# EAGLE design BlueFly-Shield_v10 (EAGLE 7.5.0)
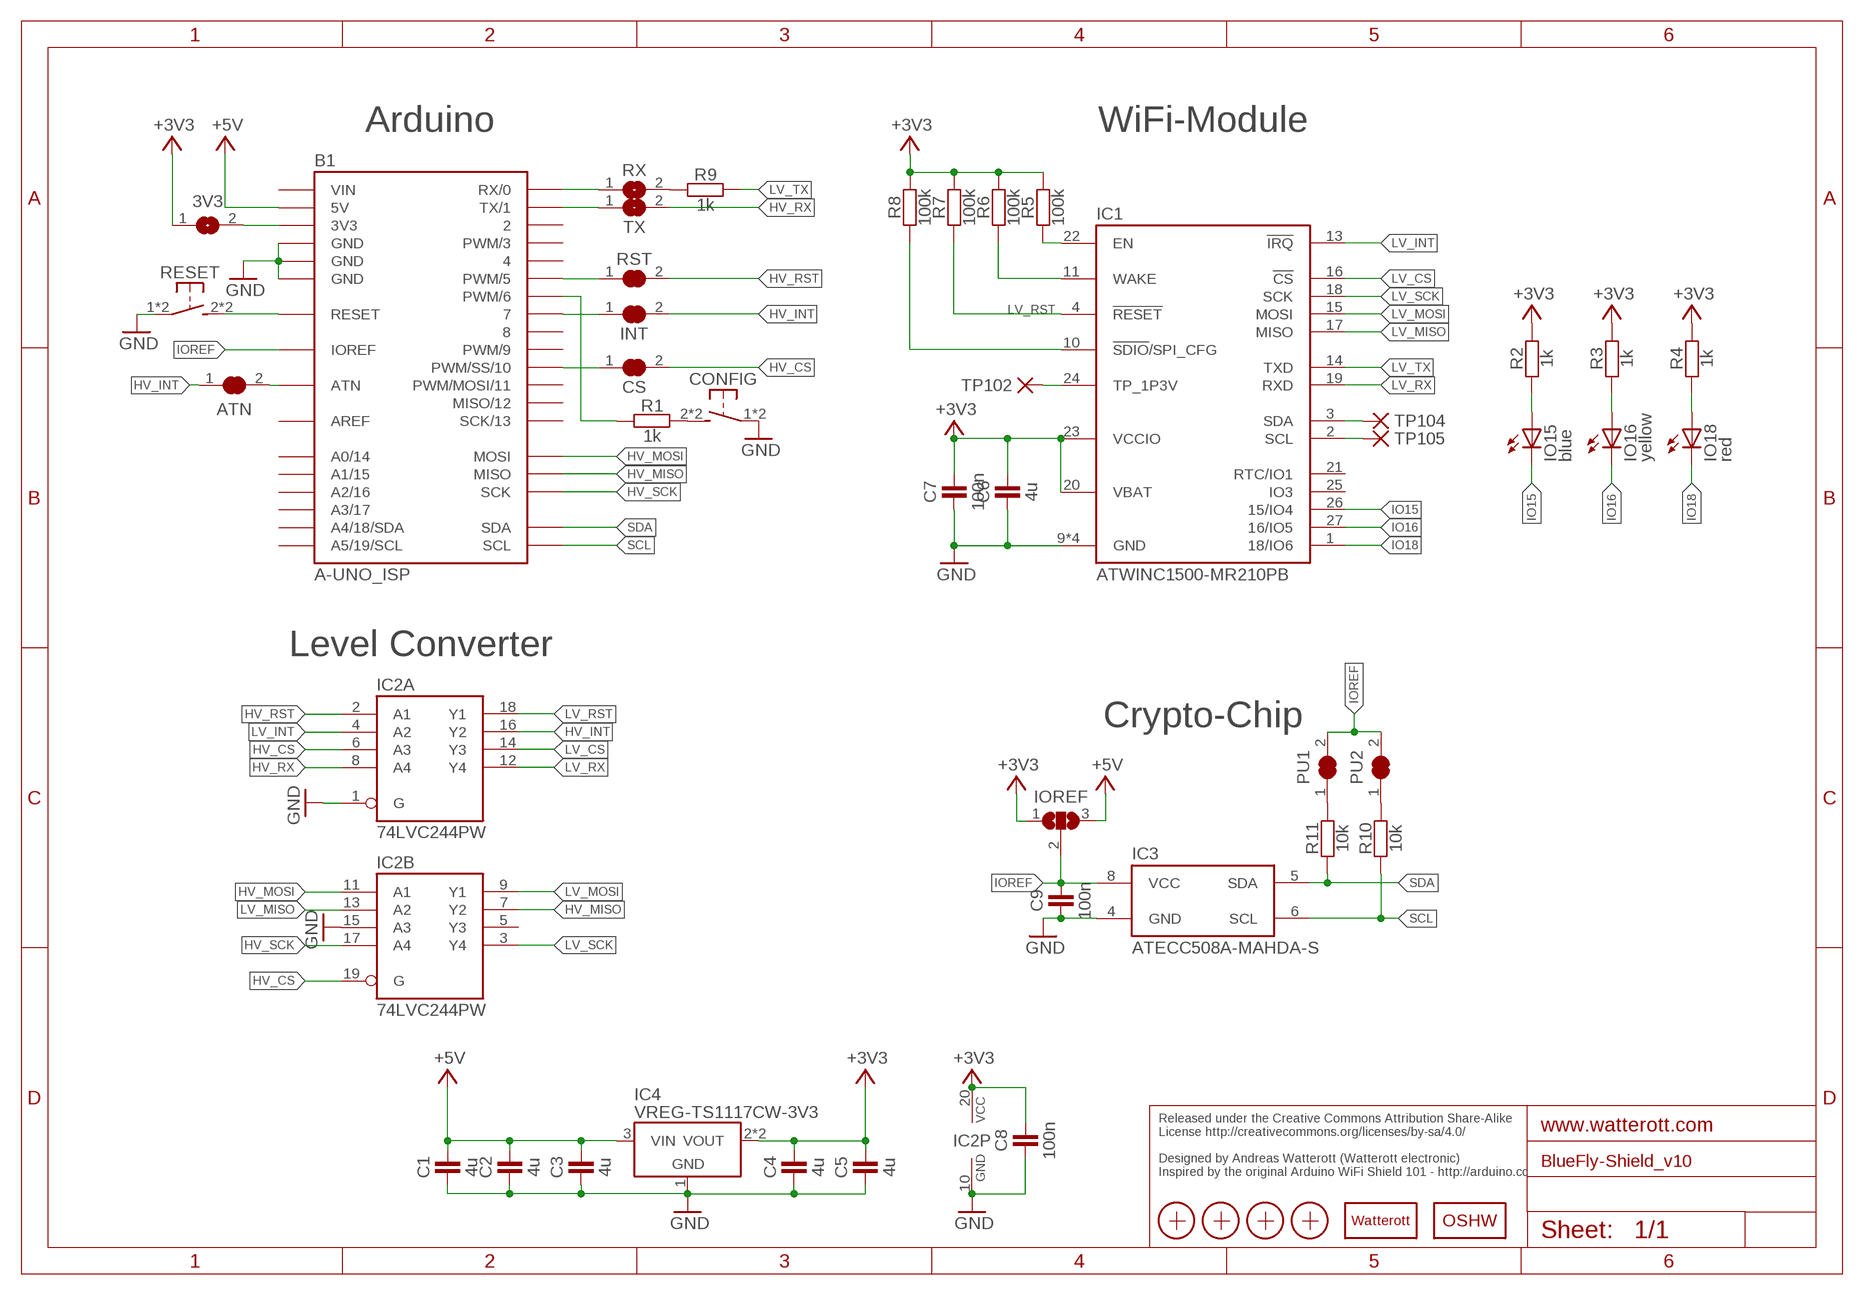
[diagram p0: schematic, sheet 1]

## Parts
3V3  JUMPER2-0603-NC  [JUMPER2-0603_NC]
ATN  JUMPER2-0603-NC  [JUMPER2-0603_NC]
B1  A-UNO_ISP  [A-UNO-ISP]
C1  4u  CAPACITOR-0603  [C0603]
C2  4u  CAPACITOR-0603  [C0603]
C3  4u  CAPACITOR-0603  [C0603]
C4  4u  CAPACITOR-0603  [C0603]
C5  4u  CAPACITOR-0603  [C0603]
C6  4u  CAPACITOR-0603  [C0603]
C7  100n  CAPACITOR-0603  [C0603]
C8  100n  CAPACITOR-0402  [C0402]
C9  100n  CAPACITOR-0402  [C0402]
CONFIG  SW-TACTILE-TL3315  [TL3315N]
CS  JUMPER2-0603-NC  [JUMPER2-0603_NC]
IC1  ATWINC1500-MR210PB  [ATWINC1500-MX210]
IC2  74LVC244PW  [TSSOP20]
IC3  ATECC508A-MAHDA-S  [UDFN8]
IC4  VREG-TS1117CW-3V3  [SOT223]
INT  JUMPER2-0603-NC  [JUMPER2-0603_NC]
IO15  blue  LED-0603  [C0603]
IO16  yellow  LED-0603  [C0603]
IO18  red  LED-0603  [C0603]
IOREF  JUMPER3-0603-NC  [JUMPER3-0603_NC]
LOGO1  LOGO-S_PLACE_M  [SPARK_TPLACE_M]
LOGO2  OSHW_LOGOX0100  [OSHW_6X100]
PU1  JUMPER2-0603-NC  [JUMPER2-0603_NC]
PU2  JUMPER2-0603-NC  [JUMPER2-0603_NC]
R1  1k  RESISTOR-0402  [C0402]
R2  1k  RESISTOR-0402  [C0402]
R3  1k  RESISTOR-0402  [C0402]
R4  1k  RESISTOR-0402  [C0402]
R5  100k  RESISTOR-0402  [C0402]
R6  100k  RESISTOR-0402  [C0402]
R7  100k  RESISTOR-0402  [C0402]
R8  100k  RESISTOR-0402  [C0402]
R9  1k  RESISTOR-0402  [C0402]
R10  10k  RESISTOR-0402  [C0402]
R11  10k  RESISTOR-0402  [C0402]
RESET  SW-TACTILE-TL3315  [TL3315N]
RST  JUMPER2-0603-NC  [JUMPER2-0603_NC]
RX  JUMPER2-0603-NC  [JUMPER2-0603_NC]
TP102  PAD-1.27X1.27_NC  [PAD-1.27X1.27_NC]
TP104  PAD-1.27X1.27_NC  [PAD-1.27X1.27_NC]
TP105  PAD-1.27X1.27_NC  [PAD-1.27X1.27_NC]
TX  JUMPER2-0603-NC  [JUMPER2-0603_NC]
X1  PASSER-07  [PASSER_07MM]
X2  PASSER-07  [PASSER_07MM]
X3  PASSER-07  [PASSER_07MM]
X4  PASSER-07  [PASSER_07MM]

## Nets
3V3: 3V3.2 B1.3V3
+3V3: 3V3.1 C4.2 C5.2 C6.2 C7.2 C8.2 IC1.20(VBAT) IC1.23(VCCIO) IC2.20(P:VCC) IC4.2(VOUT) IC4.4(VOUT) IOREF.1 R2.2 R3.2 R4.2 R5.2 R6.2 R7.2 R8.2
+5V: B1.5V C1.2 C2.2 C3.2 IC4.3(VIN) IOREF.3
ATN: ATN.2 B1.ATN
BTN: CONFIG.2(S1) CONFIG.3(S1) R1.2
D0: B1.0(RX/0) RX.1
D1: B1.1(TX/1) TX.1
D5: B1.5(PWM/5) RST.1
D7: B1.7 INT.1
D10: B1.10(PWM/SS/10) CS.1
DF6: B1.6(PWM/6) R1.1
GND: B1.GND@1(GND) B1.GND@2(GND) B1.GND@3(GND) C1.1 C2.1 C3.1 C4.1 C5.1 C6.1 C7.1 C8.1 C9.1 CONFIG.1 CONFIG.4(P1) IC1.9(GND) IC1.12(GND) IC1.28(GND) IC1.GND IC2.1(A:G) IC2.10(P:GND) IC2.15(B:A3) IC3.4(GND) IC4.1(GND) RESET.1 RESET.4(P1)
HV_CS: CS.2 IC2.6(A:A3) IC2.19(B:G)
HV_INT: ATN.1 IC2.16(A:Y2) INT.2
HV_MISO: B1.MISO IC2.7(B:Y2)
HV_MOSI: B1.MOSI IC2.11(B:A1)
HV_RST: IC2.2(A:A1) RST.2
HV_RX: IC2.8(A:A4) TX.2
HV_SCK: B1.SCK IC2.17(B:A4)
IO15: IC1.26(15/IO4) IO15.C
IO16: IC1.27(16/IO5) IO16.C
IO18: IC1.1(18/IO6) IO18.C
IOREF: B1.IOREF C9.2 IC3.8(VCC) IOREF.2 PU1.2 PU2.2
LED15: IO15.A R2.1
LED16: IO16.A R3.1
LED18: IO18.A R4.1
LV_CS: IC1.16(!CS) IC2.14(A:Y3)
LV_EN: IC1.22(EN) R5.1
LV_INT: IC1.13(!IRQ) IC2.4(A:A2)
LV_MISO: IC1.17(MISO) IC2.13(B:A2)
LV_MOSI: IC1.15(MOSI) IC2.9(B:Y1)
LV_RST: IC1.4(!RESET) IC2.18(A:Y1) R7.1
LV_RX: IC1.19(RXD) IC2.12(A:Y4)
LV_SCK: IC1.18(SCK) IC2.3(B:Y4)
LV_TX: IC1.14(TXD) R9.2
LV_WAKE: IC1.11(WAKE) R6.1
N$1: R9.1 RX.2
N$6: PU2.1 R10.2
N$7: PU1.1 R11.2
RST: B1.RST@1(RESET) RESET.2(S1) RESET.3(S1)
SCL: B1.SCL IC3.6(SCL) R10.1
SDA: B1.SDA IC3.5(SDA) R11.1
SPI_CFG: IC1.10(!SDIO!/SPI_CFG) R8.1
TP: IC1.24(TP_1P3V) TP102.1(P)
WIFI_SCL: IC1.2(SCL) TP105.1(P)
WIFI_SDA: IC1.3(SDA) TP104.1(P)
Unconnected: B1.2 B1.3(PWM/3) B1.4 B1.8 B1.9(PWM/9) B1.11(PWM/MOSI/11) B1.12(MISO/12) B1.13(SCK/13) B1.A0(A0/14) B1.A1(A1/15) B1.A2(A2/16) B1.A3(A3/17) B1.A4(A4/18/SDA) B1.A5(A5/19/SCL) IC1.21(RTC/IO1) IC1.25(IO3) IC2.5(B:Y3)

## Notes on the sheet
- Arduino | WiFi-Module
- Level Converter
- Crypto-Chip
- Released under the Creative Commons Attribution Share-Alike
  License http://creativecommons.org/licenses/by-sa/4.0/
  
  Designed by Andreas Watterott (Watterott electronic)
  Inspired by the original Arduino WiFi Shield 101 - http://arduino.cc

## Power pins joined to a net without a drawn wire
AREF: B1.AREF
VIN: B1.VIN

## Library data of the parts
3V3 ATN CS INT PU1 PU2 RST RX TX = we-rcl:JUMPER2: 2 Pin Jumpers
B1 = we-board:A-UNO_ISP: Arduino/Genuino Uno with ISP connector
C1-C9 = we-rcl:CAPACITOR: Capacitors ...2.2uF @ 6.3V -> 0402 ...4.7uF @ 6.3V -> 0603 ...10uF @ 16V -> 0805 ...22uF @ 25V -> 1206
CONFIG RESET = we-switch:SW-TACTILE: Tactile Switches; DIGIKEY: EG4621TR-ND
IC1 = we-chip:ATWINC1500: Atmel ATWINC1500-MR210 WiFi/WLAN 802.11 b/g/n MR210PB - PCB antenna MR210UB - uFL connector
IC2 = we-chip:74*244: 74x244 Octal Buffer and Line Driver (3-State); DIGIKEY: 568-1583-2-ND
IC3 = we-chip:ATECC508A: Atmel ATECC508A Crypto-Authentication Device
IC4 = we-power:VREG: Voltage Regulators (LDOs, Switching Converters...) LDOs Taiwan Semi TS1117 800mA max 15V - compatible On Semi NCP1117 1A max 20V Taiwan Semi TS9011 250mA max 12V - compatible Diodes AP2210 300mA max 15V - compatible Microchip MCP1702 250mA max 13V - compatible Microchip MCP1703 250mA max 16V - compatible Microchip MCP1754 150mA max 16V Taiwan Semi TS5204 150mA max 16V (low noise) DC/DC Converter Modules Recom R-78Ex.x-1.0-W36 1A max 28V Murata OKI-78SR-x.x/1.5-W36 1.5A max 36V
IO15 IO16 IO18 = we-opto:LED: LEDs red, green, blue -> 0603
IOREF = we-rcl:JUMPER3: 3 Pin Jumpers
LOGO1 = we-symbol:LOGO: Watterott electronic Logo
LOGO2 = we-symbol:OSHW_LOGO: Open-Source-Hardware Logo
R1-R11 = we-rcl:RESISTOR: Resistors all kinds in 0402 and 0603
TP102 TP104 TP105 = we-rcl:PAD: Pads
X1-X4 = we-symbol:PASSER: Fiducial Markers

## Board
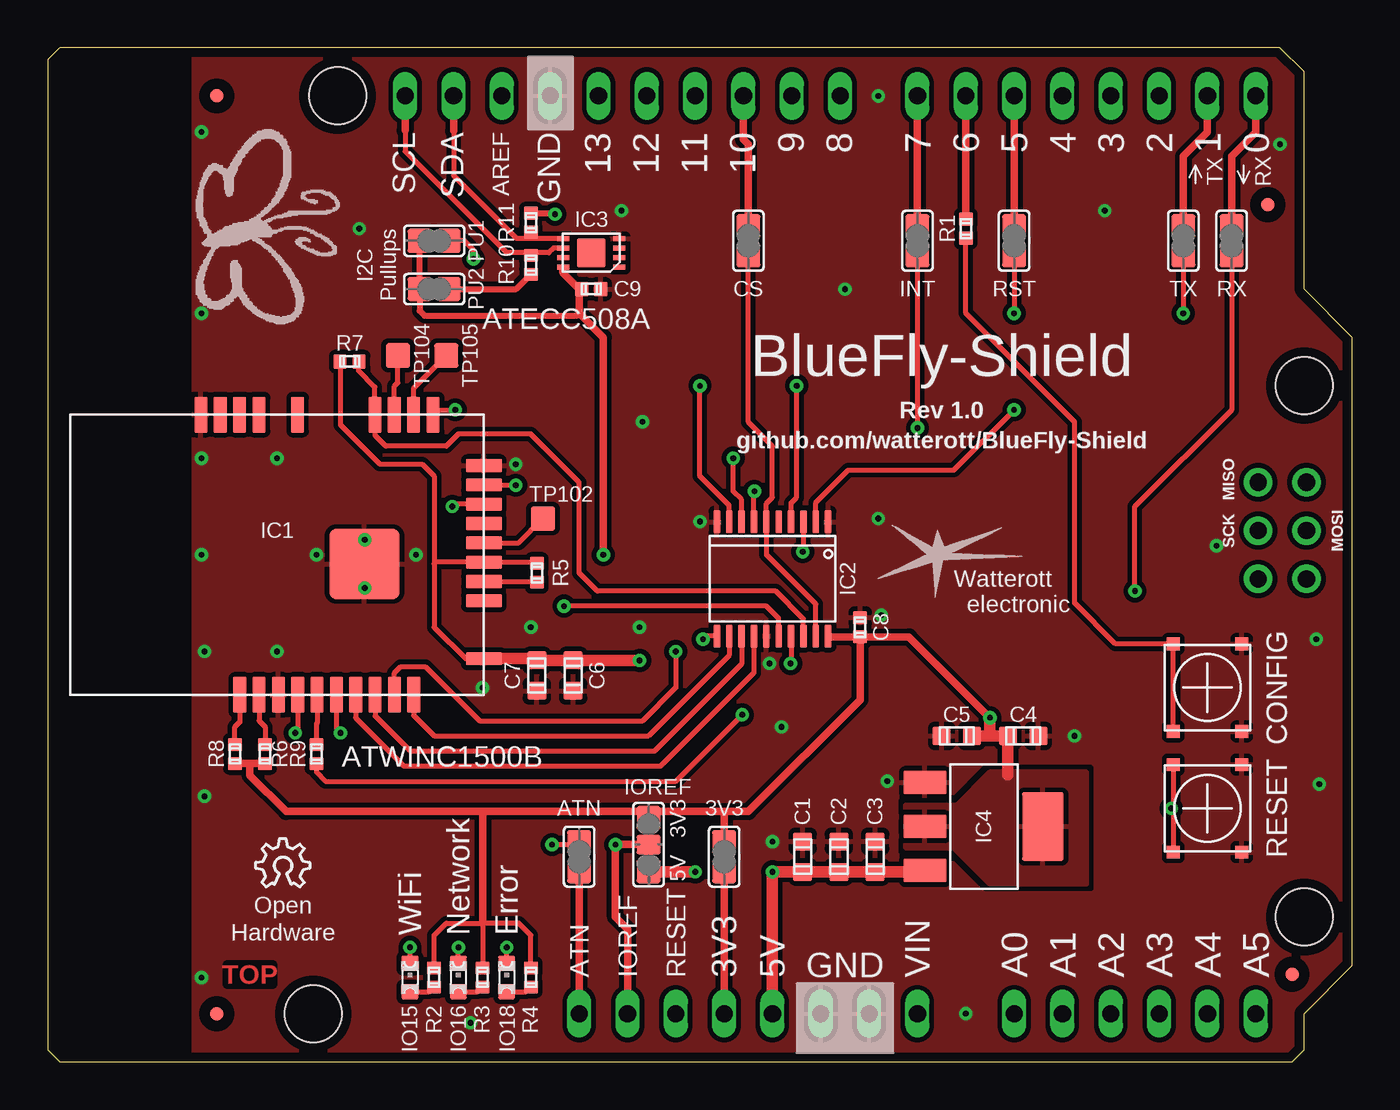
[diagram p1: board, top side]
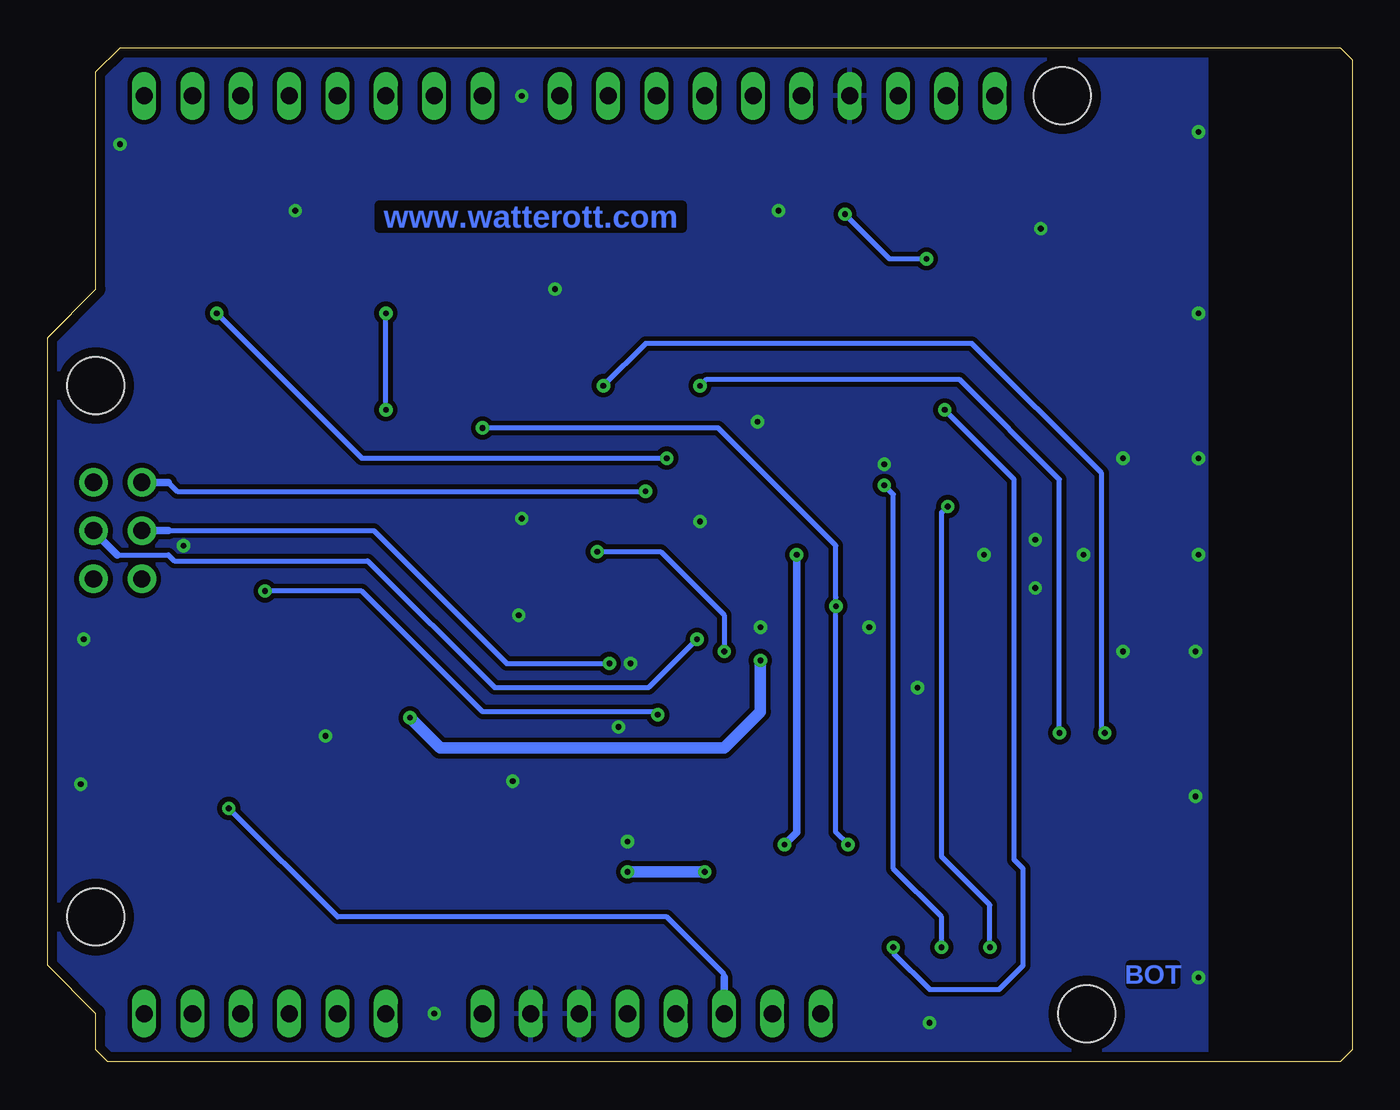
[diagram p2: board, bottom side, seen from below]

Size 68.58 x 53.34 mm. Coordinates in mm from the lower left corner, seen from the top.
Copper layers (1*16): Top 0.035mm / dielectric 1.5mm / Bottom 0.035mm
Design rules "we-dru-2-layer": minimum track width 0.15mm, minimum drill 0.3mm, track to track 0.15mm, track to pad 0.15mm, pad to pad 0.15mm, via to via 0.15mm, smd to smd 0.1mm, copper to edge 0.5mm, drill to drill 0.2mm, minimum pad ring 0.18mm, minimum via ring 0.2mm, stop-mask expansion 0.1mm, vias tented up to drill 0.5mm, thermal gap 0.25mm
tRestrict: area 0,0 to 7.3,53.3
bRestrict: area 0,0 to 7.3,53.3

### Footprints (pad centres in the part's own frame; a part is rotated, then mirrored left to right if it is on the bottom)
JUMPER2-0603_NC = smd 1.25 x 1.25: 1 0,0.76; 2 0,-0.76
A-UNO-ISP = drill 0.9 pad 1.2 long: 0 63.5,50.8; 1 60.96,50.8; 2 58.42,50.8; 3 55.88,50.8; 3V3 35.56,2.54; 4 53.34,50.8; 5 50.8,50.8; 5V 38.1,2.54; 6 48.26,50.8; 7 45.72,50.8; 8 41.656,50.8; 9 39.116,50.8; 10 36.576,50.8; 11 34.036,50.8; 12 31.496,50.8; 13 28.956,50.8; A0 50.8,2.54; A1 53.34,2.54; A2 55.88,2.54; A3 58.42,2.54; A4 60.96,2.54; A5 63.5,2.54; AREF 23.876,50.8; ATN 27.94,2.54; GND@1 40.64,2.54; GND@2 43.18,2.54; GND@3 26.416,50.8; IOREF 30.48,2.54; RST@1 33.02,2.54; SCL 18.796,50.8; SDA 21.336,50.8; VIN 45.72,2.54 | drill 0.9 pad 1.5: GND@4 66.167,25.4; MISO 63.627,30.48; MOSI 66.167,27.94; RST@2 63.627,25.4; SCK 63.627,27.94; VCC 66.167,30.48 | hole 3: 66.04,35.56; 66.04,7.62; 15.24,50.8; 13.97,2.54
C0603 = smd 1 x 0.95: 1 0,0.8; 2 0,-0.8
C0402 = smd 0.75 x 0.7: 1 0,0.5; 2 0,-0.5
TL3315N = smd 0.65 x 0.7: 1 -2.3,1.8; 2 -2.3,-1.8; 3 2.3,-1.8; 4 2.3,1.8
ATWINC1500-MX210 = smd 1.9 x 0.7: 1 7.365,-8.19; 2 7.365,-7.174; 3 7.365,-6.158; 4 7.365,-5.142; 5 7.365,-1.078; 6 7.365,0.954; 7 7.365,1.97; 8 7.365,2.986; 9 7.365,4.002; 10 -7.365,1.964; 11 -7.365,0.948; 12 -7.365,-0.068; 13 -7.365,-1.084; 14 -7.365,-2.1; 15 -7.365,-3.116; 16 -7.365,-4.132; 17 -7.365,-5.148; 18 -7.365,-6.164; 19 -7.365,-7.18 | smd 0.7 x 1.9: 20 -5.465,-10.86; 21 -2.417,-10.86; 22 -1.401,-10.86; 23 -0.385,-10.86; 24 0.631,-10.86; 25 1.647,-10.86; 26 2.663,-10.86; 27 3.679,-10.86; 28 4.695,-10.86 | smd 3.7 x 3.7: GND -0.485,-4.59
TSSOP20 = smd 1.2 x 0.35: 1 -3,2.925; 2 -3,2.275; 3 -3,1.625; 4 -3,0.975; 5 -3,0.325; 6 -3,-0.325; 7 -3,-0.975; 8 -3,-1.625; 9 -3,-2.275; 10 -3,-2.925; 11 3,-2.925; 12 3,-2.275; 13 3,-1.625; 14 3,-0.975; 15 3,-0.325; 16 3,0.325; 17 3,0.975; 18 3,1.625; 19 3,2.275; 20 3,2.925
UDFN8 = smd 0.7 x 0.28: 1 -1.475,0.75; 2 -1.475,0.25; 3 -1.475,-0.25; 4 -1.475,-0.75; 5 1.475,-0.75; 6 1.475,-0.25; 7 1.475,0.25; 8 1.475,0.75 | smd 1.5 x 1.5: TP 0,0
SOT223 = smd 2.235 x 1.219: 1 -3.099,2.311; 2 -3.099,0; 3 -3.099,-2.311 | smd 2.2 x 3.6: 4 3.099,0
C0603' = smd 0.9 x 0.8: A 0,-0.75; C 0,0.75
JUMPER3-0603_NC = smd 1.25 x 1.25: 1 0,1.4; 3 0,-1.4 | smd 1.25 x 1: 2 0,0
PAD-1.27X1.27_NC = smd 1.27 x 1.27: 1 0,0
PASSER_07MM = smd 0.7 x 0.7: X 0,0

### Placement (x,y rotation side)
3V3  35.56,10.79 0 top
ATN  27.94,10.79 0 top
B1  0,0 0 top
C1  39.69,10.79 0 top
C2  41.59,10.79 0 top
C3  43.5,10.79 0 top
C4  51.28,17.14 270 top
C5  47.78,17.14 90 top
C6  27.62,20.32 180 top
C7  25.72,20.32 180 top
C8  42.7,22.86 0 top
C9  28.57,40.64 270 top
CONFIG  60.96,19.68 270 top
CS  36.83,43.18 0 top
IC1  12.06,26.67 90 top
IC2  38.1,25.4 270 top
IC3  28.57,42.55 180 top
IC4  49.21,12.38 0 top
INT  45.72,43.18 0 top
IO15  blue  [C0603']  19.05,4.45 0 top
IO16  yellow  [C0603']  21.59,4.45 0 top
IO18  red  [C0603']  24.13,4.45 0 top
IOREF  31.59,11.43 0 top
LOGO1  46.83,26.67 0 top
LOGO2  10.95,9.21 0 top
PU1  20.32,43.18 270 top
PU2  20.32,40.64 270 top
R1  48.26,43.81 0 top
R2  20.32,4.45 180 top
R3  22.86,4.45 180 top
R4  25.4,4.45 180 top
R5  25.72,25.72 180 top
R6  11.43,16.19 0 top
R7  15.88,36.83 270 top
R8  9.84,16.19 0 top
R9  14.13,16.19 180 top
R10  25.4,41.91 0 top
R11  25.4,44.13 180 top
RESET  60.96,13.34 270 top
RST  50.8,43.18 0 top
RX  62.23,43.18 0 top
TP102  26.04,28.57 90 top
TP104  18.41,37.15 0 top
TP105  20.95,37.15 0 top
TX  59.69,43.18 0 top
X1  8.89,2.54 0 top
X2  8.89,50.8 0 top
X3  64.14,45.09 0 top
X4  65.41,4.6 0 top

### Tracks (layer width: path | path; a pad name or v marks a point on that pad's centre or on a via)
3V3
  Top 0.406: B1.3V3 3V3.2
+3V3  (via drill 0.3)
  Top 0.254: R5.2 25.65,26.29 IC1.23 20.41,26.29 20.32,26.19 | 20.32,26.19 20.32,22.86 21.98,21.2 IC1.20 | C8.2 42.86,22.36 42.7,22.2 | 41.06,22.36 IC2.20 | 22.86,7.3 R3.2 | v31.11,21.12 v31.11,21.11 | 20.32,26.19 20.32,30.8 19.68,31.43 17.46,31.43 15.4,33.5 15.4,36.81 R7.2 | R4.2 25.4,6.67 24.77,7.3 22.86,7.3 | R2.2 20.32,6.67 20.95,7.3 22.86,7.3
  Top 0.406: R8.2 10.64,15.69 | 10.64,15.69 R6.2 | C8.2 41.06,22.36 | 22.86,13.18 22.86,7.3 | 22.86,13.18 12.54,13.18 10.64,15.08 10.64,15.69 | IOREF.1 31.59,13.18 | 31.59,13.18 35.56,13.18 | 35.56,13.18 3V3.1 | 31.59,13.18 22.86,13.18 | 35.56,13.18 36.83,13.18 42.7,19.05 42.7,22.2 | 42.86,22.36 45.27,22.36 v49.53,18.1
  Top 0.61: IC1.20 25.63,21.2 C7.2 C6.2 v31.11,21.12 | 50.48,15.09 C4.2 49.53,17.14 | 49.53,17.14 C5.2 | v49.53,18.1 49.53,17.14
  Bottom 0.61: v49.53,18.1 47.94,16.51 33.02,16.51 31.11,18.41 v31.11,21.11
  pour Top (isolate 0.254): 45.09,13.49 45.09,11.27 47.62,11.27 49.53,9.37 54.61,9.37 54.61,15.24 49.53,15.24 47.78,13.49
+5V  (via drill 0.3)
  Top 0.406: 46.04,9.99 IC4.3 | IOREF.3 31.59,10 | v38.11,9.99 v38.1,10
  Top 0.61: B1.5V v38.1,10 | 46.04,9.99 C3.2 C2.2 C1.2 v38.11,9.99 | 31.59,10 v34.04,10
  Bottom 0.61: v34.04,10 v38.1,10
ATN
  Top 0.406: B1.ATN ATN.2
BTN
  Top 0.254: CONFIG.3 CONFIG.2 56.12,21.98 53.98,24.13 53.98,33.66 48.26,39.37 R1.2
D0
  Top 0.406: B1.0 63.5,48.9 62.23,47.62 RX.1
D1
  Top 0.406: B1.1 60.96,48.9 59.69,47.62 TX.1
D5
  Top 0.406: B1.5 RST.1
D7
  Top 0.406: B1.7 INT.1
D10
  Top 0.406: B1.10 36.58,48.51 36.83,48.26 CS.1
DF6
  Top 0.406: B1.6 R1.1
GND  (via drill 0.3)
  other vias: 8.1,31.75 8.1,39.37 8.1,48.9 8.1,4.45 64.77,48.26 8.26,21.59 8.1,26.67 12.06,21.59 24.61,31.43 66.83,14.61 66.67,22.23 43.66,50.8 48.26,2.54 44.13,14.76 34.29,28.42 43.81,23.5 12.06,31.75 16.67,27.46 30.16,44.77 38.1,11.59 53.98,17.14 43.66,28.57 31.11,22.86 38.58,17.62 25.4,22.86 22.23,2.06 16.38,43.81 31.27,33.66 55.56,44.77 8.26,13.97 37.94,20.95 61.44,27.15 22.86,19.68 41.91,40.64 16.67,24.92 14.13,26.67 19.37,26.67
  pour Top (isolate 0.25, rank 2): 68.58,0 0,0 0,53.34 68.58,53.34
  pour Bottom (isolate 0.25, rank 2): 0,0 68.58,0 68.58,53.34 0,53.34
HV_CS
  Top 0.254: CS.2 36.83,33.66 38.1,32.38 38.1,29.69 37.77,29.36 IC2.6 37.77,26.68 40.38,24.08 IC2.19
HV_INT  (via drill 0.3)
  Top 0.254: INT.2 v45.72,33.34 | v26.51,11.43 27.82,11.43 ATN.1 | IC2.16 38.42,23.33 37.78,23.97 v27.15,23.97
  Bottom 0.254: v26.51,11.43 27.15,12.06 v27.15,23.97 27.15,24.45 27.15,27.15 33.34,33.34 v45.72,33.34
HV_MISO  (via drill 0.3)
  Top 0.254: IC2.7 37.12,29.98 v37.15,30
  Bottom 0.254: v37.15,30 61.75,30 62.23,30.48
  Bottom 0.406: B1.MISO 62.23,30.48
HV_MOSI  (via drill 0.3)
  Top 0.254: IC2.11 34.62,22.4 v34.45,22.23
  Bottom 0.254: B1.MOSI 66.17,27.91 | 64.93,26.67 62.23,26.67 61.91,26.35 51.75,26.35 45.09,19.68 36.99,19.68 v34.45,22.23
  Bottom 0.406: 66.17,27.91 64.93,26.67
HV_RST  (via drill 0.3)
  Top 0.254: RST.2 v50.8,39.37 | IC2.2 40.38,29.42 42.07,31.11 47.62,31.11 v50.8,34.29
  Bottom 0.254: v50.8,34.29 v50.8,39.37
HV_RX  (via drill 0.3)
  Top 0.254: TX.2 v59.69,39.37 | IC2.8 36.48,29.57 36.04,30 v36.04,31.75
  Bottom 0.254: v36.04,31.75 52.07,31.75 v59.69,39.37
HV_SCK  (via drill 0.3)
  Top 0.254: IC2.17 39.08,20.98 v39.05,20.95
  Bottom 0.254: 62.23,27.94 51.44,27.94 44.45,20.95 v39.05,20.95
  Bottom 0.406: B1.SCK 62.23,27.94
IO15  (via drill 0.3)
  Top 0.254: IO15.C v19.05,6.03 | IC1.26 21.39,29.33 v21.27,29.21
  Bottom 0.254: v19.05,6.03 19.05,8.26 21.59,10.79 21.59,28.89 v21.27,29.21
IO16  (via drill 0.3)
  Top 0.254: IO16.C v21.59,6.03 | IC1.27 24.58,30.35 v24.61,30.32
  Bottom 0.254: v21.59,6.03 21.59,7.62 24.13,10.16 24.13,29.84 v24.61,30.32
IO18  (via drill 0.3)
  Top 0.254: IO18.C v24.13,6.03 | IC1.1 20.25,34.23 20.32,34.29 v21.43,34.29
  Bottom 0.254: v24.13,6.03 24.13,5.71 22.23,3.81 18.57,3.81 17.3,5.08 17.3,10.16 17.78,10.64 17.78,30.64 v21.43,34.29
IOREF  (via drill 0.3)
  Top 0.254: IC3.8 27.1,41.48 | 27.94,40.64 C9.2
  Top 0.305: 27.1,41.48 27.05,41.48 27.05,41.78 | PU1.2 PU2.2 19.56,39.49 19.81,39.24 27.81,39.24 27.94,39.37
  Top 0.406: 27.1,41.48 27.94,40.64 27.94,39.37 29.21,38.1 v29.21,26.67 | B1.IOREF 30.48,6.99 29.84,7.62 v29.84,11.43 IOREF.2
  Bottom 0.406: v29.21,26.67 29.21,12.06 v29.84,11.43
LED15
  Top 0.254: IO15.A 20.07,3.69 R2.1
LED16
  Top 0.254: IO16.A 22.61,3.69 R3.1
LED18
  Top 0.254: IO18.A 25.15,3.69 R4.1
LV_CS
  Top 0.254: IC1.16 16.2,18.09 18.73,15.56 32.23,15.56 37.12,20.46 IC2.14
LV_EN
  Top 0.254: IC1.22 25.67,25.27 R5.1
LV_INT  (via drill 0.3)
  Top 0.254: IC1.13 13.15,17.43 v13.02,17.3 | IC2.4 39.08,29.39 39.37,29.69 v39.37,35.56
  Bottom 0.254: v13.02,17.3 13.18,17.46 13.18,30.96 20,37.78 37.15,37.78 v39.37,35.56
LV_MISO
  Top 0.254: IC1.17 17.21,18.19 19.05,16.35 31.91,16.35 36.48,20.92 IC2.13
LV_MOSI  (via drill 0.3)
  Top 0.254: IC1.15 15.18,17.52 v15.4,17.3 | v34.29,35.56 34.29,30.8 35.83,29.26 IC2.9
  Bottom 0.254: v34.29,35.56 33.97,35.88 20.64,35.88 15.4,30.64 v15.4,17.3
LV_RST
  Top 0.254: R7.1 16.35,36.81 16.35,36.35 17.21,35.5 IC1.4 17.21,32.96 17.78,32.38 20.95,32.38 21.59,33.02 25.4,33.02 27.94,30.48 27.94,25.72 28.89,24.77 38.26,24.77 39.73,23.3 IC2.18
LV_RX
  Top 0.254: IC1.19 19.25,18.22 20.32,17.14 31.59,17.14 35.83,21.38 IC2.12
LV_SCK  (via drill 0.3)
  Top 0.254: IC1.18 18.23,20.45 18.57,20.8 19.84,20.8 22.7,17.94 31.27,17.94 33.02,19.68 v33.02,21.59 | IC2.3 39.73,26.87 v39.69,26.83
  Bottom 0.254: v39.69,26.83 36.35,26.83 33.02,23.5 v33.02,21.59
LV_TX
  Top 0.254: IC1.14 14.16,17.82 14.13,17.78 R9.2
LV_WAKE
  Top 0.254: IC1.11 11.12,17.93 11.43,17.62 R6.1
N$1  (via drill 0.3)
  Top 0.254: v57.15,24.77 57.15,29.21 62.23,34.29 RX.2 | R9.1 14.13,15.24 14.61,14.76 33.02,14.76 v36.51,18.26
  Bottom 0.254: v36.51,18.26 36.67,18.41 45.72,18.41 52.07,24.77 v57.15,24.77
N$2
  Top 0.2: 36.83,43.81 36.83,42.55
N$3
  Top 0.2: 45.72,43.81 45.72,42.55
N$4
  Top 0.2: 50.8,43.81 50.8,42.55
N$5
  Top 0.2: 27.94,11.43 27.94,10.16
N$6
  Top 0.305: PU2.1 24.63,40.64 R10.2
N$7  (via drill 0.3)
  Top 0.2: 19.81,43.18 PU1.1
  Top 0.254: v22.38,42.23 22.38,42.7 21.91,43.18 PU1.1
  Top 0.305: R11.2 26.61,44.63 v26.67,44.58
  Bottom 0.254: v22.38,42.23 24.32,42.23 v26.67,44.58
N$8
  Top 0.2: 19.68,40.64 20.95,40.64
RST  (via drill 0.3)
  Top 0.254: RESET.2 59.16,13.34 | 59.16,13.34 RESET.3 | v59.05,13.34 59.16,13.34
  Bottom 0.254: 33.02,4.45 33.02,4.6 36.04,7.62 53.34,7.62 v59.05,13.34
  Bottom 0.406: B1.RST@1 33.02,4.45
SCL
  Top 0.254: IC3.6 26.6,42.8 26.35,42.55 25.4,42.55 | 25.4,42.55 24.13,42.55 18.8,47.88 18.8,48.99 | R10.1 25.4,42.55
  Top 0.406: B1.SCL 18.8,48.99
SDA
  Top 0.254: IC3.5 25.4,43.3 | 25.4,43.3 24.65,43.3 21.34,46.61 21.34,48.96 | R11.1 25.4,43.3
  Top 0.406: B1.SDA 21.34,48.96
SPI_CFG
  Top 0.254: IC1.10 10.1,17.88 9.84,17.62 R8.1
TP
  Top 0.254: IC1.24 24.76,27.3 TP102.1
WIFI_SCL
  Top 0.254: IC1.2 19.24,35.43 TP105.1
WIFI_SDA
  Top 0.254: IC1.3 18.22,35.53 18.41,35.72 TP104.1

### Text on the board
Top: TOP
Bottom: www.watterott.com | BOT
tPlace: SCL | SDA | AREF | GND | 13 | 12 | 11 | 10 | 9 | 8 | 7 | 6 | 5 | 4 | 3 | 2 | 1 | 0 | TX | RX | I2C / Pullups | ATECC508A | BlueFly-Shield | Rev 1.0 | github.com/watterott/BlueFly-Shield | MISO | SCK | MOSI | Watterott / electronic | ATWINC1500B | 3V3 | 5V | Open | Hardware | WiFi | Network | Error | ATN | IOREF | RESET | 3V3 | 5V | GND | VIN | A0 | A1 | A2 | A3 | A4 | A5
Reference: Silkscreen: 21 tPlace